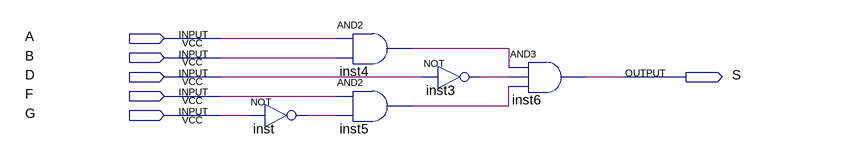
[diagram p0: schematic sheet]
// Quartus schematic Block9.bdf as structural Verilog: 5 symbols, 6 pins
module Block9 (
  input  A,
  input  B,
  input  D,
  input  F,
  input  G,
  output S
);

  wire inst3_out, inst4_out, inst5_out, inst_out;

  not inst (inst_out, G);
  and inst4 (inst4_out, A, B);
  and inst5 (inst5_out, F, inst_out);
  not inst3 (inst3_out, D);
  and inst6 (S, inst4_out, inst3_out, inst5_out);
endmodule
